# Altium project STM32总装.PrjPCB
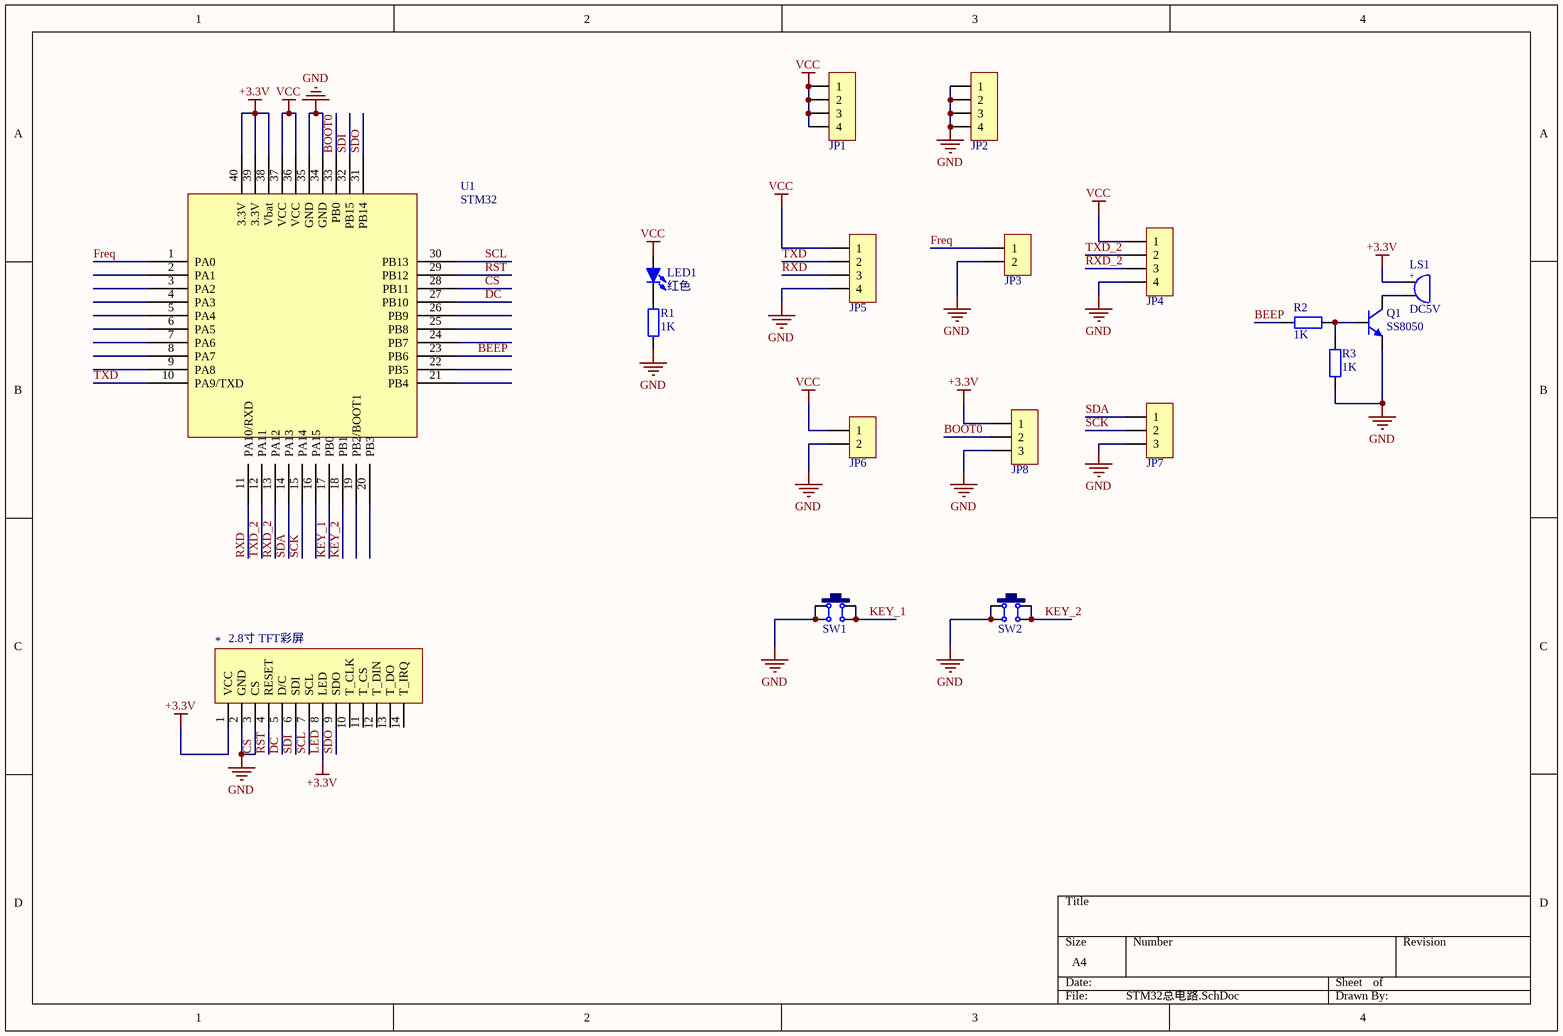
[diagram p0: STM32总电路.SchDoc]
1 sheet, 18 parts. Net scope: global (net labels, ports and power ports of the same name join across sheets).
Board file: STM32总装电路.PcbDoc

## Sheet STM32总电路.SchDoc
size A4

### Parts
*  2.8寸 TFT彩屏  [2.8寸TFT屏幕]
JP1  HDR-1X4  [HDR2.54-LI-4P]  (value not drawn)
JP2  HDR-1X4  [HDR2.54-LI-4P]  (value not drawn)
JP3  HDR-1X2  [XH2.54-LI-2P]  (value not drawn)
JP4  HDR-1X4  [XH2.54-LI-4P]  (value not drawn)
JP5  HDR-1X4  [XH2.54-LI-4P]  (value not drawn)
JP6  HDR-1X2  [XH2.54-LI-2P]  (value not drawn)
JP7  HDR-1X3  [HDR2.54-LI-3P]  (value not drawn)
JP8  HDR-1X3  [HDR2.54-LI-3P]  (value not drawn)
LED1  红色  [LED 5MM-B]
LS1  DC5V  [BEEP 6.5x12x8.5]
Q1  SS8050  [TO92A]
R1  1K  [RS 1/4W]
R2  1K  [RS 1/4W]
R3  1K  [RS 1/4W]
SW1  6x6x5  [TSW DIP-6*6*6]  (value not drawn)
SW2  6x6x5  [TSW DIP-6*6*6]  (value not drawn)
U1  STM32  [STM32自制最小系统]

### Nets
CS: *.2(GND) *.3(CS) JP2.1 JP2.2 JP2.3 JP2.4 JP3.2 JP4.4 JP5.4 JP6.2 JP7.3 JP8.3 Q1.1(E) R1.1 R3.1 SW1.1 SW1.4 SW2.1 SW2.4 U1.28(PB11) U1.34(GND) U1.35(GND)  [also labelled GND]
LED: *.1(VCC) *.8(LED) JP8.1 LS1.1 U1.38(Vbat) U1.39(3.3V) U1.40(3.3V)  [also labelled +3.3V]
VCC: JP1.1 JP1.2 JP1.3 JP1.4 JP4.1 JP5.1 JP6.1 LED1.1(A) U1.36(VCC) U1.37(VCC)
BEEP: R2.1 U1.23(PB6)
BOOT0: JP8.2 U1.33(PB0)
DC: *.5(D/C) U1.27(PB10)
Freq: JP3.1 U1.1(PA0)
KEY_1: SW1.2 SW1.3 U1.17(PB0)
KEY_2: SW2.2 SW2.3 U1.18(PB1)
RST: *.4(RESET) U1.29(PB12)
RXD: JP5.3 U1.11(PA10/RXD)
RXD_2: JP4.3 U1.13(PA12)
SCK: JP7.2 U1.15(PA14)
SCL: *.7(SCL) U1.30(PB13)
SDA: JP7.1 U1.14(PA13)
SDI: *.6(SDI) U1.32(PB15)
SDO: *.9(SDO) U1.31(PB14)
TXD: JP5.2 U1.10(PA9/TXD)
TXD_2: JP4.2 U1.12(PA11)
NetLED1_2: LED1.2(K) R1.2
NetLS1_2: LS1.2 Q1.3(C)
NetQ1_2: Q1.2(B) R2.2 R3.2

Not connected (* = marked no-connect by the designer): * 10(T_CLK) 11(T_CS) 12(T_DIN) 13(T_DO) 14(T_IRQ); U1 2(PA1) 3(PA2) 4(PA3) 5(PA4) 6(PA5) 7(PA6) 8(PA7) 9(PA8) 16(PA15) 19(PB2/BOOT1) 20(PB3) 21(PB4) 22(PB5) 24(PB7) 25(PB8) 26(PB9)

### Notes on the sheet
- (in symbol BEEP) +

### Library data of the parts
JP1 JP2 JP4 JP5 = Header 4: 4P接插件; 版权归属: 源创客; BOM名称: 4P接插件; 学习资源: www.ooocke.com
JP3 JP6 = Header 2: 2P接插件; 版权归属: 源创客; BOM名称: 2P接插件; 学习资源: www.ooocke.com
JP7 JP8 = Header 3: 3P接插件; 版权归属: 源创客; BOM名称: 3P接插件; 学习资源: www.ooocke.com
LED1 = LED-5MM: 5mm插件LED; 版权归属: 源创客; BOM名称: 5mm插件LED; 学习资源: www.ooocke.com
LS1 = BEEP: 蜂鸣器; 版权归属: 源创客; BOM名称: 蜂鸣器; 学习资源: www.ooocke.com
Q1 = 8050-DIP: 高频放大-NPN型; 版权归属: 源创客; 属性: 40V 1.5A 1W 100MHZ; BOM名称: 高频放大-NPN型; 学习资源: www.ooocke.com
R1-R3 = R-CRR: 直插色环电阻; BOM名称: 色环电阻; 版权归属: 源创客; 学习资源: www.ooocke.com
SW1 SW2 = TSW DIP-6x6: 直插6x6轻触开关; 版权归属: 源创客; BOM名称: 直插6x6轻触开关; 学习资源: www.ooocke.com
U1 = STM32最小系统: STM32最小系统自制